# EAGLE design FreedomFighterPif (EAGLE 6.5.0)

## Sheet 1 of 2
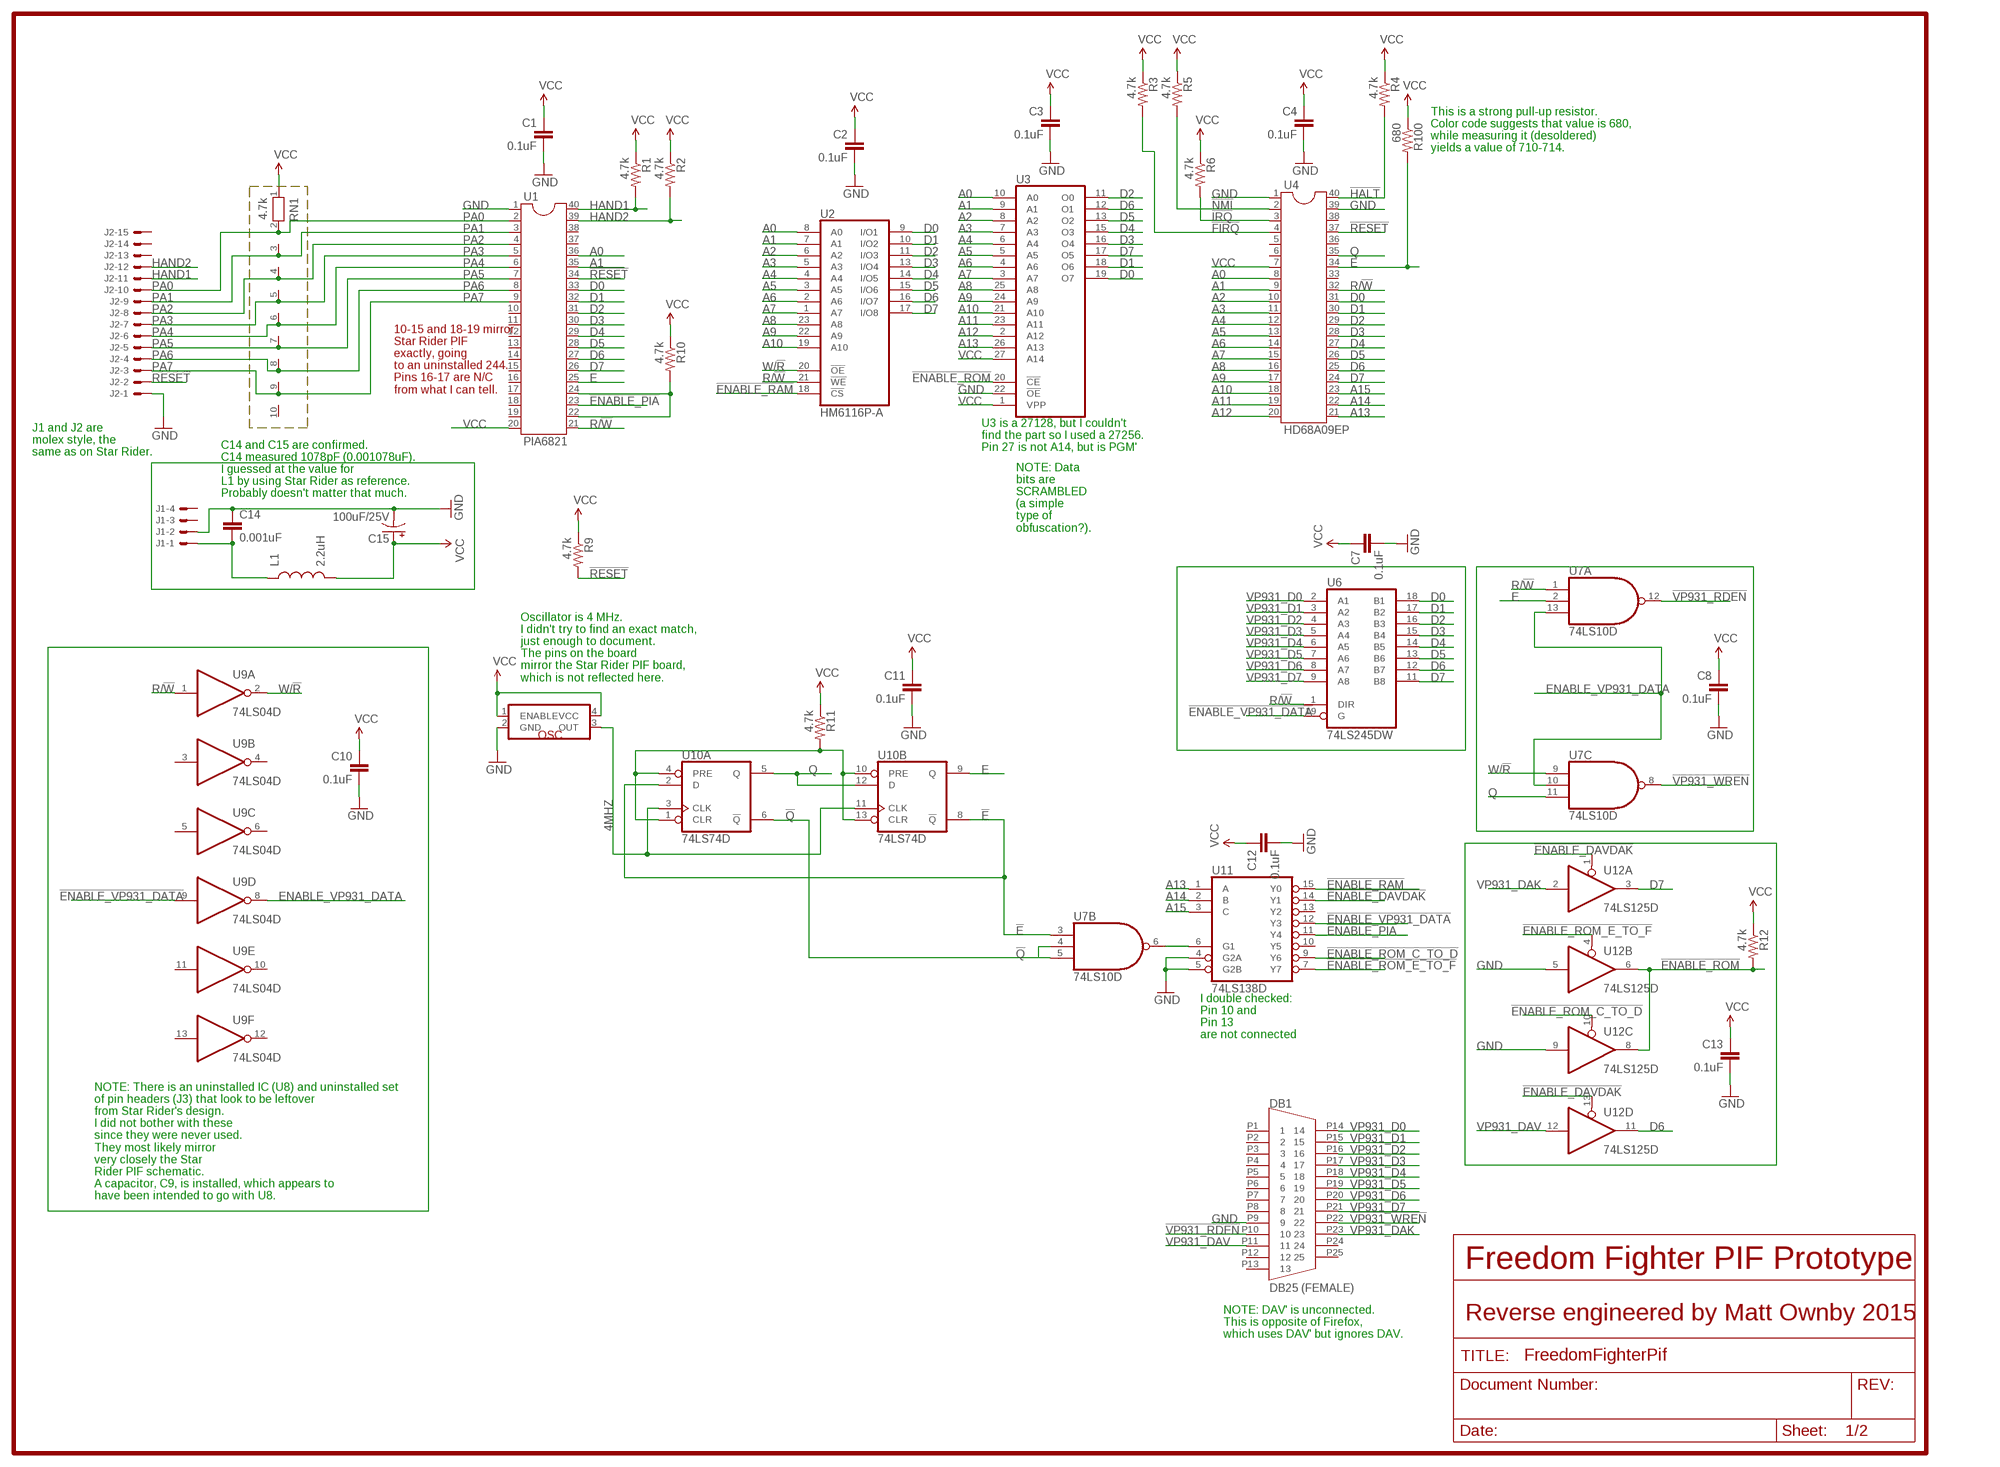
[diagram p0: schematic, sheet 1]

### Parts
C1  0.1uF  CAP1206  [1206]
C2  0.1uF  CAP1206  [1206]
C3  0.1uF  CAP1206  [1206]
C4  0.1uF  CAP1206  [1206]
C7  0.1uF  CAP1206  [1206]
C8  0.1uF  CAP1206  [1206]
C10  0.1uF  CAP1206  [1206]
C11  0.1uF  CAP1206  [1206]
C12  0.1uF  CAP1206  [1206]
C13  0.1uF  CAP1206  [1206]
C14  0.001uF  CAP1206  [1206]
C15  100uF/25V  CAP_POLPTH2  [CPOL-RADIAL-10UF-25V]
DB1  DB25 (FEMALE)  A32077-ND  [A32077-ND]
J1  KK-156-4  [KK-156-4]
J2  KK-156-15  [KK-156-15]
L1  2.2uH  INDUCTOR1206H*  [INDUCTOR-1206]
R1  4.7k  RESISTOR1206  [1206]
R2  4.7k  RESISTOR1206  [1206]
R3  4.7k  RESISTOR1206  [1206]
R4  4.7k  RESISTOR1206  [1206]
R5  4.7k  RESISTOR1206  [1206]
R6  4.7k  RESISTOR1206  [1206]
R9  4.7k  RESISTOR1206  [1206]
R10  4.7k  RESISTOR1206  [1206]
R11  4.7k  RESISTOR1206  [1206]
R12  4.7k  RESISTOR1206  [1206]
R100  680  RESISTOR1206  [1206]
RN1  4.7k  RN09  [RN-10]
U1  PIA6821  DIL40  [DIL40]
U2  HM6116P-A  6116S  [SO24-2]
U3  27256  [DIL28]
U4  HD68A09EP  DIL40  [DIL40]
U6  74LS245DW  [SO20W]
U7  74LS10D  [SO14]
U9  74LS04D  [SO14]
U10  74LS74D  [SO14]
U11  74LS138D  [SO16]
U12  74LS125D  [SO14]
U$1  OSCILLATOR-SMT4  [SMT4-7MMX5MM]

### Nets
4MHZ: U10.3(A:CLK) U10.11(B:CLK) U$1.3(OUT)
!E: U7.3(B:I0) U10.2(A:D) U10.8(B:!Q)
!ENABLE_DAVDAK: U11.14(Y1) U12.1(A:OE) U12.13(D:OE) ; also sheet 2
!ENABLE_PIA: U1.23 U11.11(Y4) ; also sheet 2
!ENABLE_RAM: U2.18(!CS) U11.15(Y0) ; also sheet 2
!ENABLE_ROM: R12.2 U3.20(!CE) U12.6(B:O) U12.8(C:O)
!ENABLE_ROM_C_TO_D: U11.9(Y6) U12.10(C:OE) ; also sheet 2
!ENABLE_ROM_E_TO_F: U11.7(Y7) U12.4(B:OE) ; also sheet 2
!ENABLE_VP931_DATA: U6.19(G) U9.9(D:I) U11.12(Y3) ; also sheet 2
!FIRQ: R3.2 U4.4 ; also sheet 2
!HALT: R4.2 U4.40 ; also sheet 2
!IRQ: R6.2 U4.3 ; also sheet 2
!NMI: R5.2 U4.2 ; also sheet 2
!Q: U7.4(B:I1) U7.5(B:I2) U10.6(A:!Q)
!RESET: J2.2 R9.2 U1.34 U4.37 ; also sheet 2
!VP931_RDEN: DB1.P10 U7.12(A:O)
!VP931_WREN: DB1.P22 U7.8(C:O)
A0: U1.36 U2.8(A0) U3.10(A0) U4.8 ; also sheet 2
A1: U1.35 U2.7(A1) U3.9(A1) U4.9 ; also sheet 2
A2: U2.6(A2) U3.8(A2) U4.10 ; also sheet 2
A3: U2.5(A3) U3.7(A3) U4.11 ; also sheet 2
A4: U2.4(A4) U3.6(A4) U4.12 ; also sheet 2
A5: U2.3(A5) U3.5(A5) U4.13 ; also sheet 2
A6: U2.2(A6) U3.4(A6) U4.14 ; also sheet 2
A7: U2.1(A7) U3.3(A7) U4.15 ; also sheet 2
A8: U2.23(A8) U3.25(A8) U4.16 ; also sheet 2
A9: U2.22(A9) U3.24(A9) U4.17 ; also sheet 2
A10: U2.19(A10) U3.21(A10) U4.18 ; also sheet 2
A11: U3.23(A11) U4.19 ; also sheet 2
A12: U3.2(A12) U4.20 ; also sheet 2
A13: U3.26(A13) U4.21 U11.1(A) ; also sheet 2
A14: U4.22 U11.2(B) ; also sheet 2
A15: U4.23 U11.3(C) ; also sheet 2
CS0/CS1: R10.2 U1.22 U1.24
D0: U1.33 U2.9(I/O1) U3.19(O7) U4.31 U6.18(B1) ; also sheet 2
D1: U1.32 U2.10(I/O2) U3.18(O6) U4.30 U6.17(B2) ; also sheet 2
D2: U1.31 U2.11(I/O3) U3.11(O0) U4.29 U6.16(B3) ; also sheet 2
D3: U1.30 U2.13(I/O4) U3.16(O4) U4.28 U6.15(B4) ; also sheet 2
D4: U1.29 U2.14(I/O5) U3.15(O3) U4.27 U6.14(B5) ; also sheet 2
D5: U1.28 U2.15(I/O6) U3.13(O2) U4.26 U6.13(B6) ; also sheet 2
D6: U1.27 U2.16(I/O7) U3.12(O1) U4.25 U6.12(B7) U12.11(D:O) ; also sheet 2
D7: U1.26 U2.17(I/O8) U3.17(O5) U4.24 U6.11(B8) U12.3(A:O) ; also sheet 2
E: R100.2 U1.25 U4.34 U7.2(A:I1) U10.9(B:Q) ; also sheet 2
ENABLE_VP931_DATA: U7.10(C:I1) U7.13(A:I2) U9.8(D:O) ; also sheet 2
GND: C1.2 C2.2 C3.2 C4.2 C7.2 C8.2 C10.2 C11.2 C12.2 C13.2 C14.1 C15.2(-) DB1.P9 J1.2 J2.1 U1.1 U3.22(!OE) U4.1 U4.39 U11.4(G2A) U11.5(G2B) U12.5(B:I) U12.9(C:I) U$1.2(GND) ; also sheet 2
HAND1: J2.11 R1.2 U1.40 ; also sheet 2
HAND2: J2.12 R2.2 U1.39 ; also sheet 2
N$4: U7.6(B:O) U11.6(G1)
N$5: R11.2 U10.1(A:CLR) U10.4(A:PRE) U10.10(B:PRE) U10.13(B:CLR)
N$8: C14.2 J1.1 L1.P$1
PA0: J2.10 RN1.2 U1.2 ; also sheet 2
PA1: J2.9 RN1.3 U1.3 ; also sheet 2
PA2: J2.8 RN1.4 U1.4 ; also sheet 2
PA3: J2.7 RN1.5 U1.5 ; also sheet 2
PA4: J2.6 RN1.6 U1.6 ; also sheet 2
PA5: J2.5 RN1.7 U1.7 ; also sheet 2
PA6: J2.4 RN1.8 U1.8 ; also sheet 2
PA7: J2.3 RN1.9 U1.9 ; also sheet 2
Q: U4.35 U7.11(C:I2) U10.5(A:Q) U10.12(B:D) ; also sheet 2
R/!W: U1.21 U2.21(!WE) U4.32 U6.1(DIR) U7.1(A:I0) U9.1(A:I) ; also sheet 2
VCC: C1.1 C2.1 C3.1 C4.1 C7.1 C8.1 C10.1 C11.1 C12.1 C13.1 C15.1(+) L1.P$2 R1.1 R2.1 R3.1 R4.1 R5.1 R6.1 R9.1 R10.1 R11.1 R12.1 R100.1 RN1.1 U1.20 U3.1(VPP) U3.27(A14) U4.7 U$1.1(ENABLE) U$1.4(VCC) ; also sheet 2
VP931_D0: DB1.P14 U6.2(A1)
VP931_D1: DB1.P15 U6.3(A2)
VP931_D2: DB1.P16 U6.4(A3)
VP931_D3: DB1.P17 U6.5(A4)
VP931_D4: DB1.P18 U6.6(A5)
VP931_D5: DB1.P19 U6.7(A6)
VP931_D6: DB1.P20 U6.8(A7)
VP931_D7: DB1.P21 U6.9(A8)
VP931_DAK: DB1.P23 U12.2(A:I)
VP931_DAV: DB1.P11 U12.12(D:I)
W/!R: U2.20(!OE) U7.9(C:I0) U9.2(A:O) ; also sheet 2
Unconnected: DB1.P1 DB1.P2 DB1.P3 DB1.P4 DB1.P5 DB1.P6 DB1.P7 DB1.P8 DB1.P12 DB1.P13 DB1.P24 DB1.P25 J1.3 J1.4 J2.13 J2.14 J2.15 RN1.10 U1.10 U1.11 U1.12 U1.13 U1.14 U1.15 U1.16 U1.17 U1.18 U1.19 U1.37 U1.38 U4.5 U4.6 U4.33 U4.36 U4.38 U9.3(B:I) U9.4(B:O) U9.5(C:I) U9.6(C:O) U9.10(E:O) U9.11(E:I) U9.12(F:O) U9.13(F:I) U11.10(Y5) U11.13(Y2)

### Notes on the sheet
- This is a strong pull-up resistor.
  Color code suggests that value is 680,
  while measuring it (desoldered) 
  yields a value of 710-714.
- 10-15 and 18-19 mirror
  Star Rider PIF
  exactly, going
  to an uninstalled 244.
  Pins 16-17 are N/C
  from what I can tell.
- U3 is a 27128, but I couldn't
  find the part so I used a 27256.
  Pin 27 is not A14, but is PGM'
- J1 and J2 are
  molex style, the
  same as on Star Rider.
- C14 and C15 are confirmed.
  C14 measured 1078pF (0.001078uF).
  I guessed at the value for
  L1 by using Star Rider as reference.
  Probably doesn't matter that much.
- NOTE: Data
  bits are
  SCRAMBLED
  (a simple
  type of
  obfuscation?).
- Oscillator is 4 MHz.
  I didn't try to find an exact match,
  just enough to document.
  The pins on the board
  mirror the Star Rider PIF board,
  which is not reflected here.
- I double checked:
  Pin 10 and 
  Pin 13
  are not connected
- NOTE: There is an uninstalled IC (U8) and uninstalled set
  of pin headers (J3) that look to be leftover
  from Star Rider's design.
  I did not bother with these
  since they were never used.
  They most likely mirror
  very closely the Star
  Rider PIF schematic.
  A capacitor, C9, is installed, which appears to
  have been intended to go with U8.
- Freedom Fighter PIF Prototype
- Reverse engineered by Matt Ownby 2015
- NOTE: DAV' is unconnected.
  This is opposite of Firefox,
  which uses DAV' but ignores DAV.

## Sheet 2 of 2
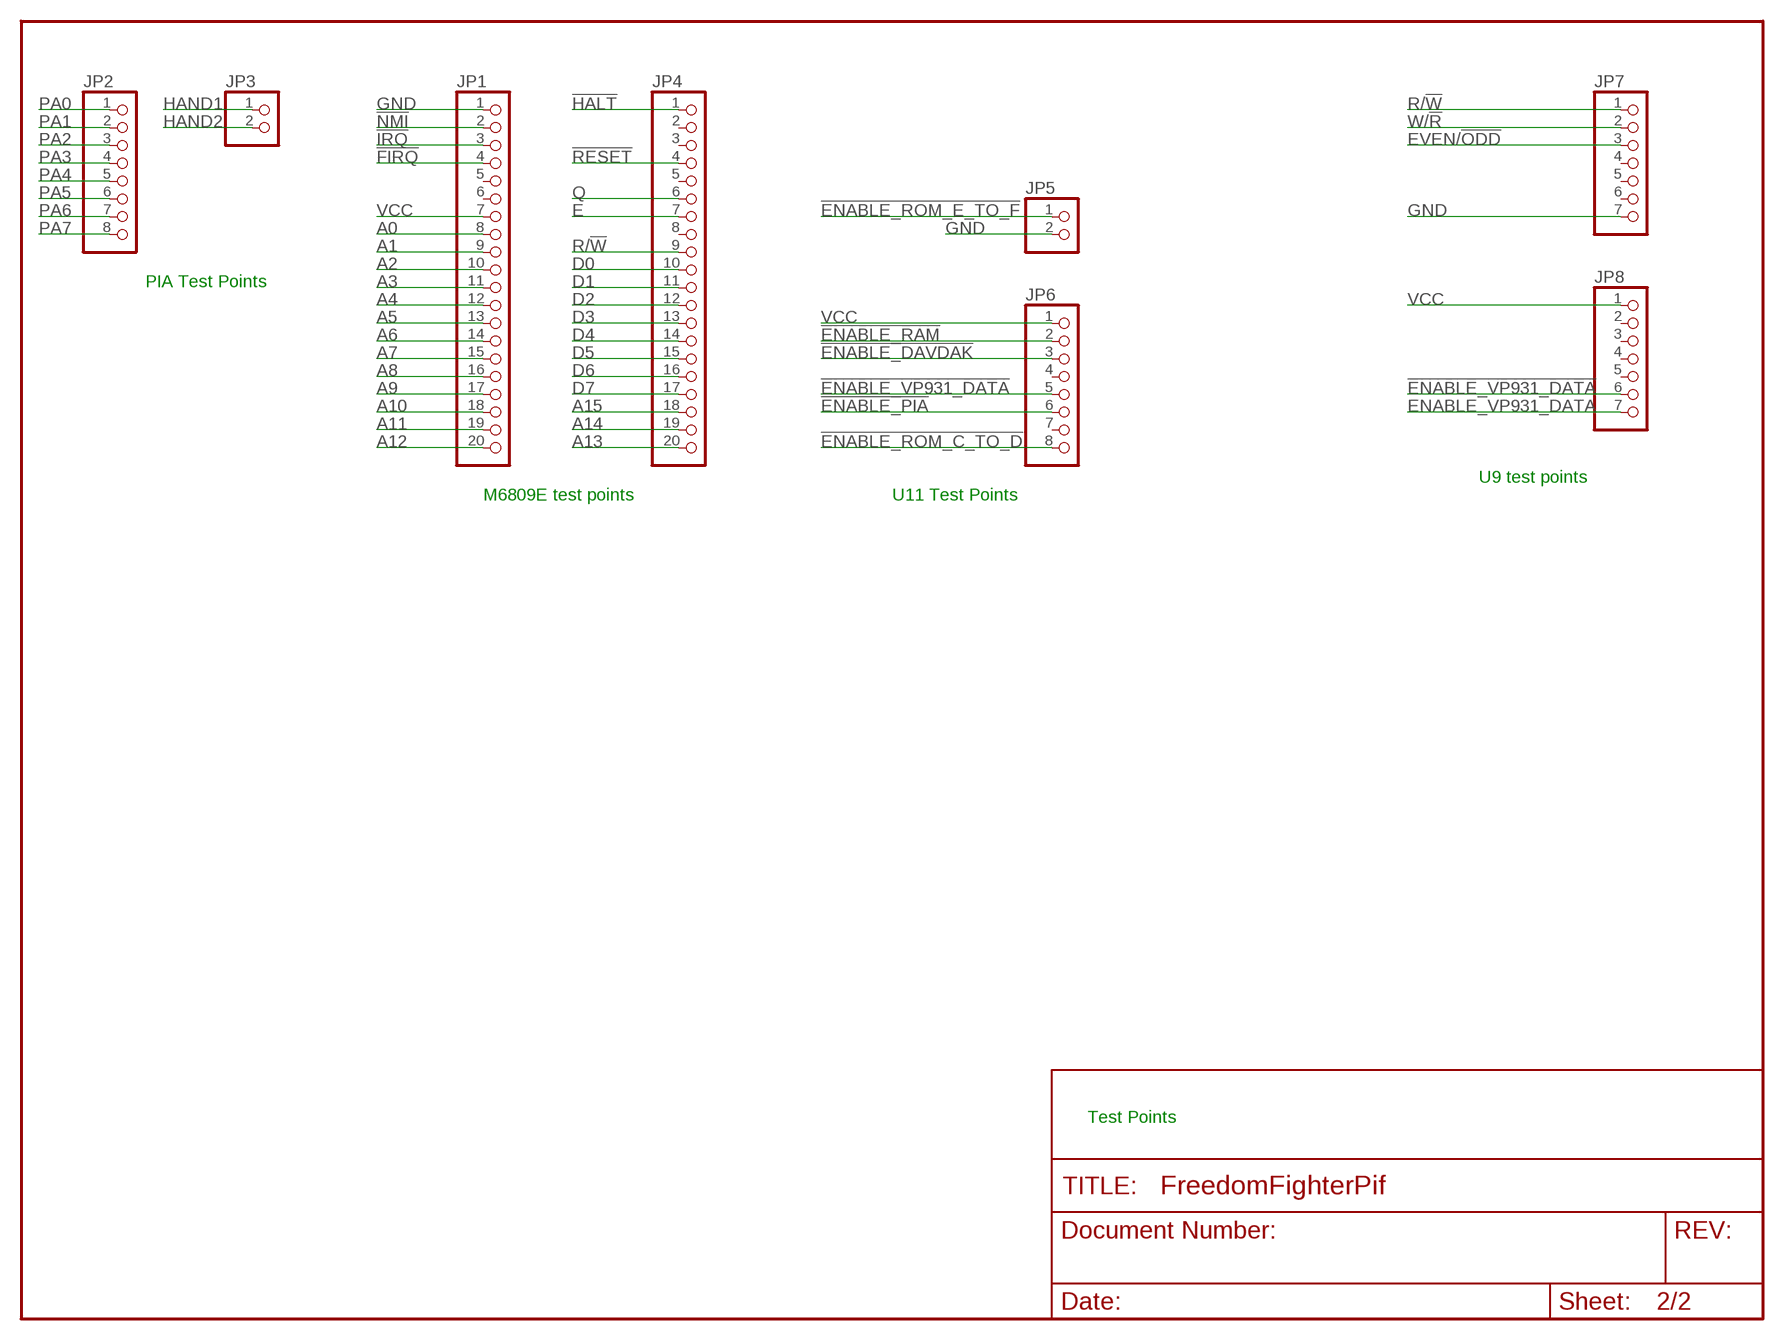
[diagram p1: schematic, sheet 2]

### Parts
JP1  PINHD-1X20  [1X20]
JP2  PINHD-1X8  [1X08]
JP3  PINHD-1X2  [1X02]
JP4  PINHD-1X20  [1X20]
JP5  PINHD-1X2  [1X02]
JP6  PINHD-1X8  [1X08]
JP7  PINHD-1X7  [1X07]
JP8  PINHD-1X7  [1X07]

### Nets
!ENABLE_DAVDAK: JP6.3 ; also sheet 1
!ENABLE_PIA: JP6.6 ; also sheet 1
!ENABLE_RAM: JP6.2 ; also sheet 1
!ENABLE_ROM_C_TO_D: JP6.8 ; also sheet 1
!ENABLE_ROM_E_TO_F: JP5.1 ; also sheet 1
!ENABLE_VP931_DATA: JP6.5 JP8.6 ; also sheet 1
!FIRQ: JP1.4 ; also sheet 1
!HALT: JP4.1 ; also sheet 1
!IRQ: JP1.3 ; also sheet 1
!NMI: JP1.2 ; also sheet 1
!RESET: JP4.4 ; also sheet 1
A0: JP1.8 ; also sheet 1
A1: JP1.9 ; also sheet 1
A2: JP1.10 ; also sheet 1
A3: JP1.11 ; also sheet 1
A4: JP1.12 ; also sheet 1
A5: JP1.13 ; also sheet 1
A6: JP1.14 ; also sheet 1
A7: JP1.15 ; also sheet 1
A8: JP1.16 ; also sheet 1
A9: JP1.17 ; also sheet 1
A10: JP1.18 ; also sheet 1
A11: JP1.19 ; also sheet 1
A12: JP1.20 ; also sheet 1
A13: JP4.20 ; also sheet 1
A14: JP4.19 ; also sheet 1
A15: JP4.18 ; also sheet 1
D0: JP4.10 ; also sheet 1
D1: JP4.11 ; also sheet 1
D2: JP4.12 ; also sheet 1
D3: JP4.13 ; also sheet 1
D4: JP4.14 ; also sheet 1
D5: JP4.15 ; also sheet 1
D6: JP4.16 ; also sheet 1
D7: JP4.17 ; also sheet 1
E: JP4.7 ; also sheet 1
ENABLE_VP931_DATA: JP8.7 ; also sheet 1
EVEN/!ODD: JP7.3
GND: JP1.1 JP5.2 JP7.7 ; also sheet 1
HAND1: JP3.1 ; also sheet 1
HAND2: JP3.2 ; also sheet 1
PA0: JP2.1 ; also sheet 1
PA1: JP2.2 ; also sheet 1
PA2: JP2.3 ; also sheet 1
PA3: JP2.4 ; also sheet 1
PA4: JP2.5 ; also sheet 1
PA5: JP2.6 ; also sheet 1
PA6: JP2.7 ; also sheet 1
PA7: JP2.8 ; also sheet 1
Q: JP4.6 ; also sheet 1
R/!W: JP4.9 JP7.1 ; also sheet 1
VCC: JP1.7 JP6.1 JP8.1 ; also sheet 1
W/!R: JP7.2 ; also sheet 1
Unconnected: JP1.5 JP1.6 JP4.2 JP4.3 JP4.5 JP4.8 JP6.4 JP6.7 JP7.4 JP7.5 JP7.6 JP8.2 JP8.3 JP8.4 JP8.5

### Notes on the sheet
- PIA Test Points
- U9 test points
- M6809E test points | U11 Test Points
- Test Points

## Power pins joined to a net without a drawn wire
GND: U2.12(GND) U3.14(GND) U6.10(GND) U7.7(P:GND) U9.7(P:GND) U10.7(P:GND) U11.8(GND) U12.7(P:GND)
VCC: U2.24(VCC) U3.28(VCC) U6.20(VCC) U7.14(P:VCC) U9.14(P:VCC) U10.14(P:VCC) U11.16(VCC) U12.14(P:VCC)

## Library data of the parts
C1-C4 C7 C8 C10-C14 = SparkFun:CAP: Capacitor Standard 0603 ceramic capacitor, and 0.1" leaded capacitor.
C15 = SparkFun:CAP_POL: Capacitor Polarized These are standard SMD and PTH capacitors. Normally 10uF, 47uF, and 100uF in electrolytic and tantalum varieties. Always verify the external diameter of the through hole cap, it varies with capacity, voltage, and manufacturer. The EIA devices should be standard.
DB1 = mpo:A32077-ND: DB2 female right-angle Digikey A32077-ND
J1 = con-molex:KK-156-4: KK 156 HEADER Source: http://www.molex.com/pdm_docs/sd/026604100_sd.pdf; OC_FARNELL: unknown; OC_NEWARK: unknown
J2 = con-molex:KK-156-15: KK 156 HEADER Source: http://www.molex.com/pdm_docs/sd/026604100_sd.pdf; OC_FARNELL: unknown; OC_NEWARK: unknown
JP1 JP4 = pinhead:PINHD-1X20: PIN HEADER
JP2 JP6 = pinhead:PINHD-1X8: PIN HEADER
JP3 JP5 = pinhead:PINHD-1X2: PIN HEADER
JP7 JP8 = pinhead:PINHD-1X7: PIN HEADER
L1 = SparkFun:INDUCTOR: Inductors Basic Inductor/Choke - 0603 and 1206. Footprints are not proven and vary greatly between part numbers.
R1-R6 R9-R12 R100 = SparkFun:RESISTOR: Resistor Basic schematic elements and footprints for 0603, 1206, and PTH resistors.
RN1 = resistor-net:RN09: RESISTOR NETWORK; OC_FARNELL: unknown; OC_NEWARK: unknown
U1 U4 = ic-package:DIL40: Dual In Line
U2 = memory-idt:6116S: MEMORY; OC_FARNELL: unknown; OC_NEWARK: unknown
U3 = memory:27256: MEMORY
U6 = 74xx-us:74*245: Octal BUS TRANSCEIVER, 3-state
U7 = 74xx-us:74*10: Triple 3-input NAND gate
U9 = 74xx-us:74*04: Hex INVERTER
U10 = 74xx-us:74*74: Dual D type positive edge triggered FLIP FLOP, preset and clear
U11 = 74xx-us:74*138: 3-line to 8-line DECODER/DEMULTIPLEXER
U12 = 74xx-eu:74*125: Quad bus BUFFER, 3-state
U$1 = mpo:OSCILLATOR-SMT4

## Board
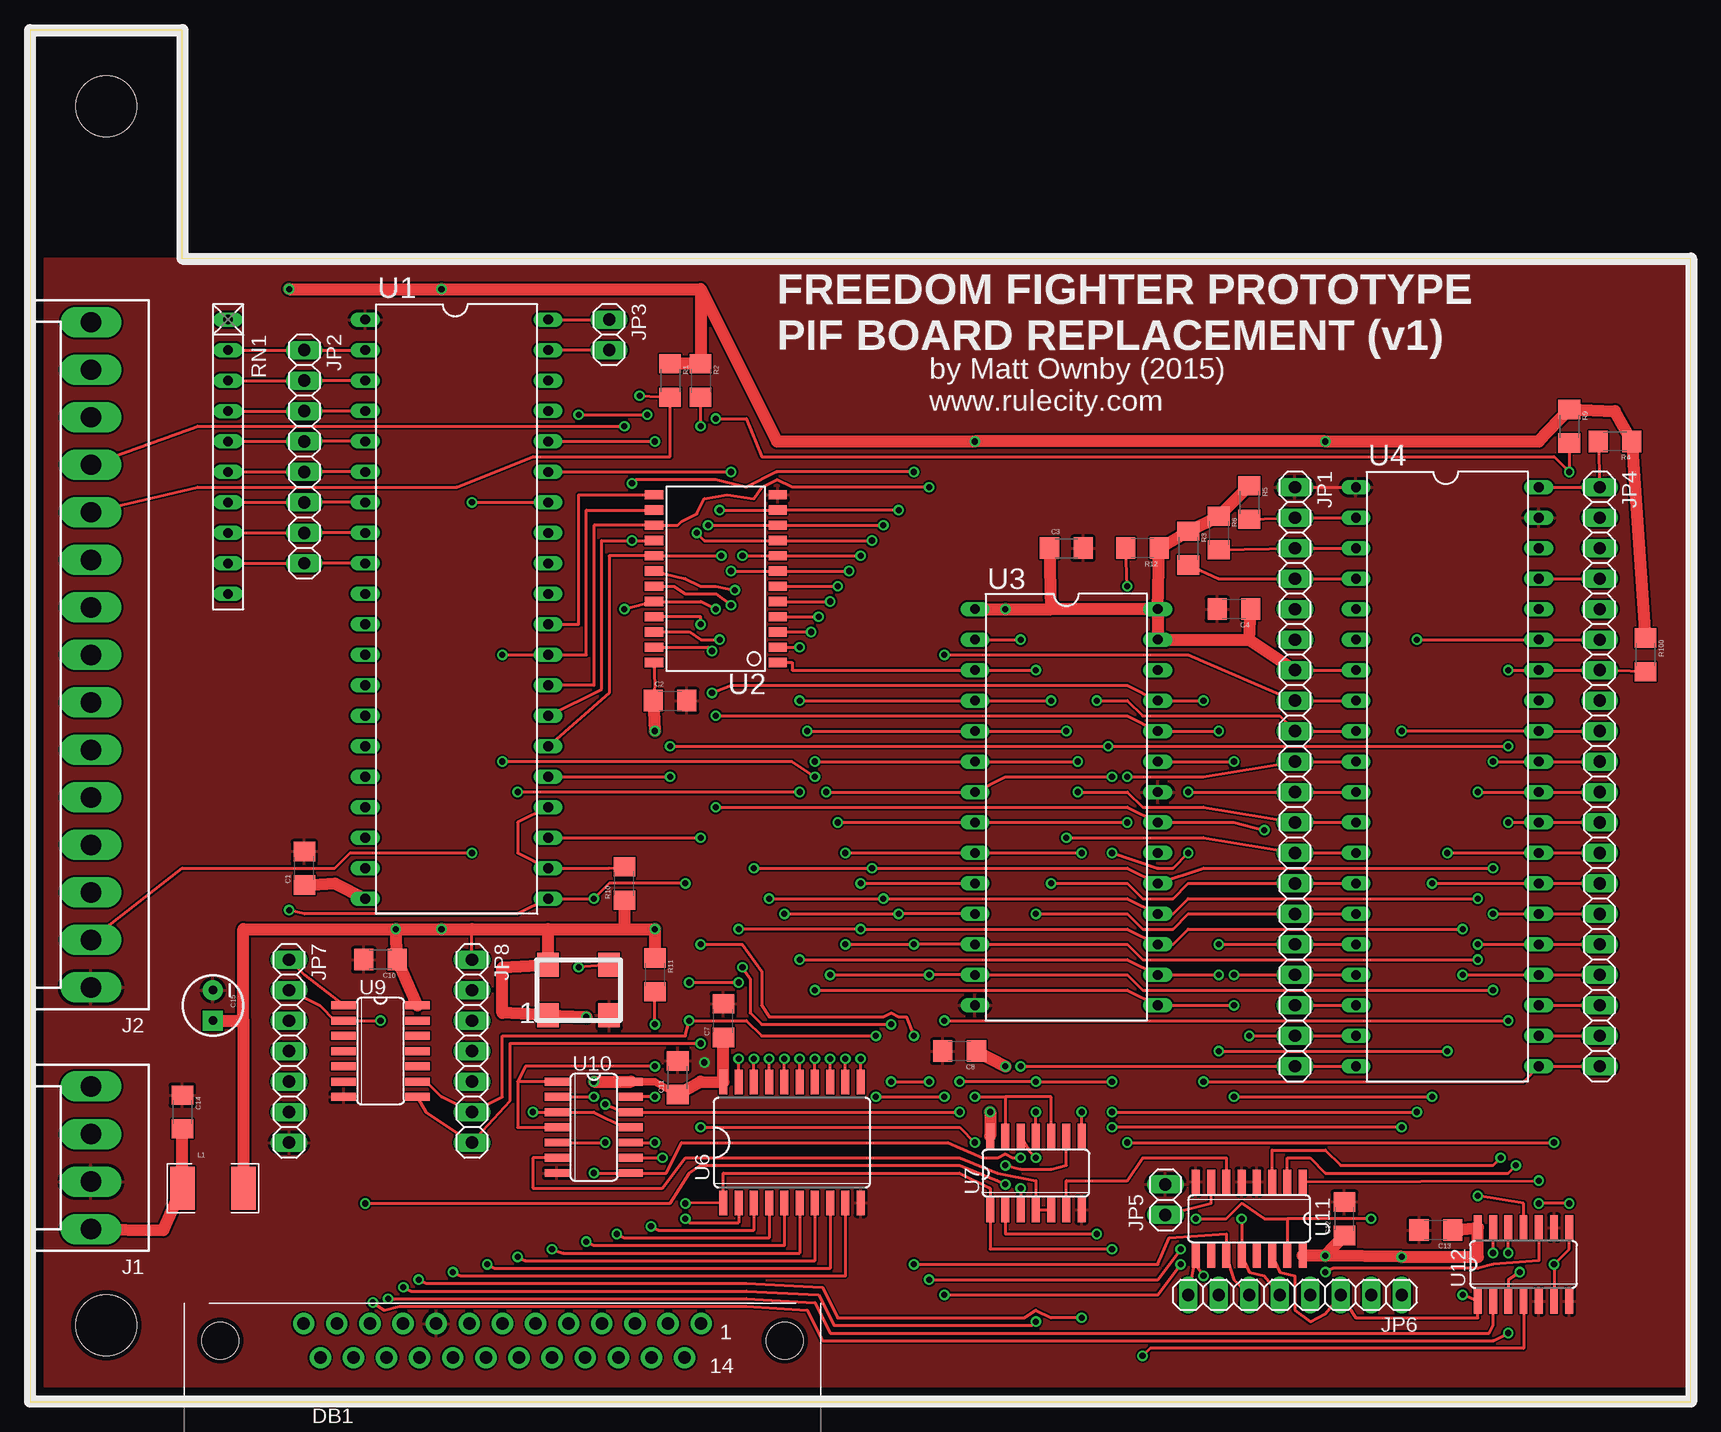
[diagram p2: board, top side]
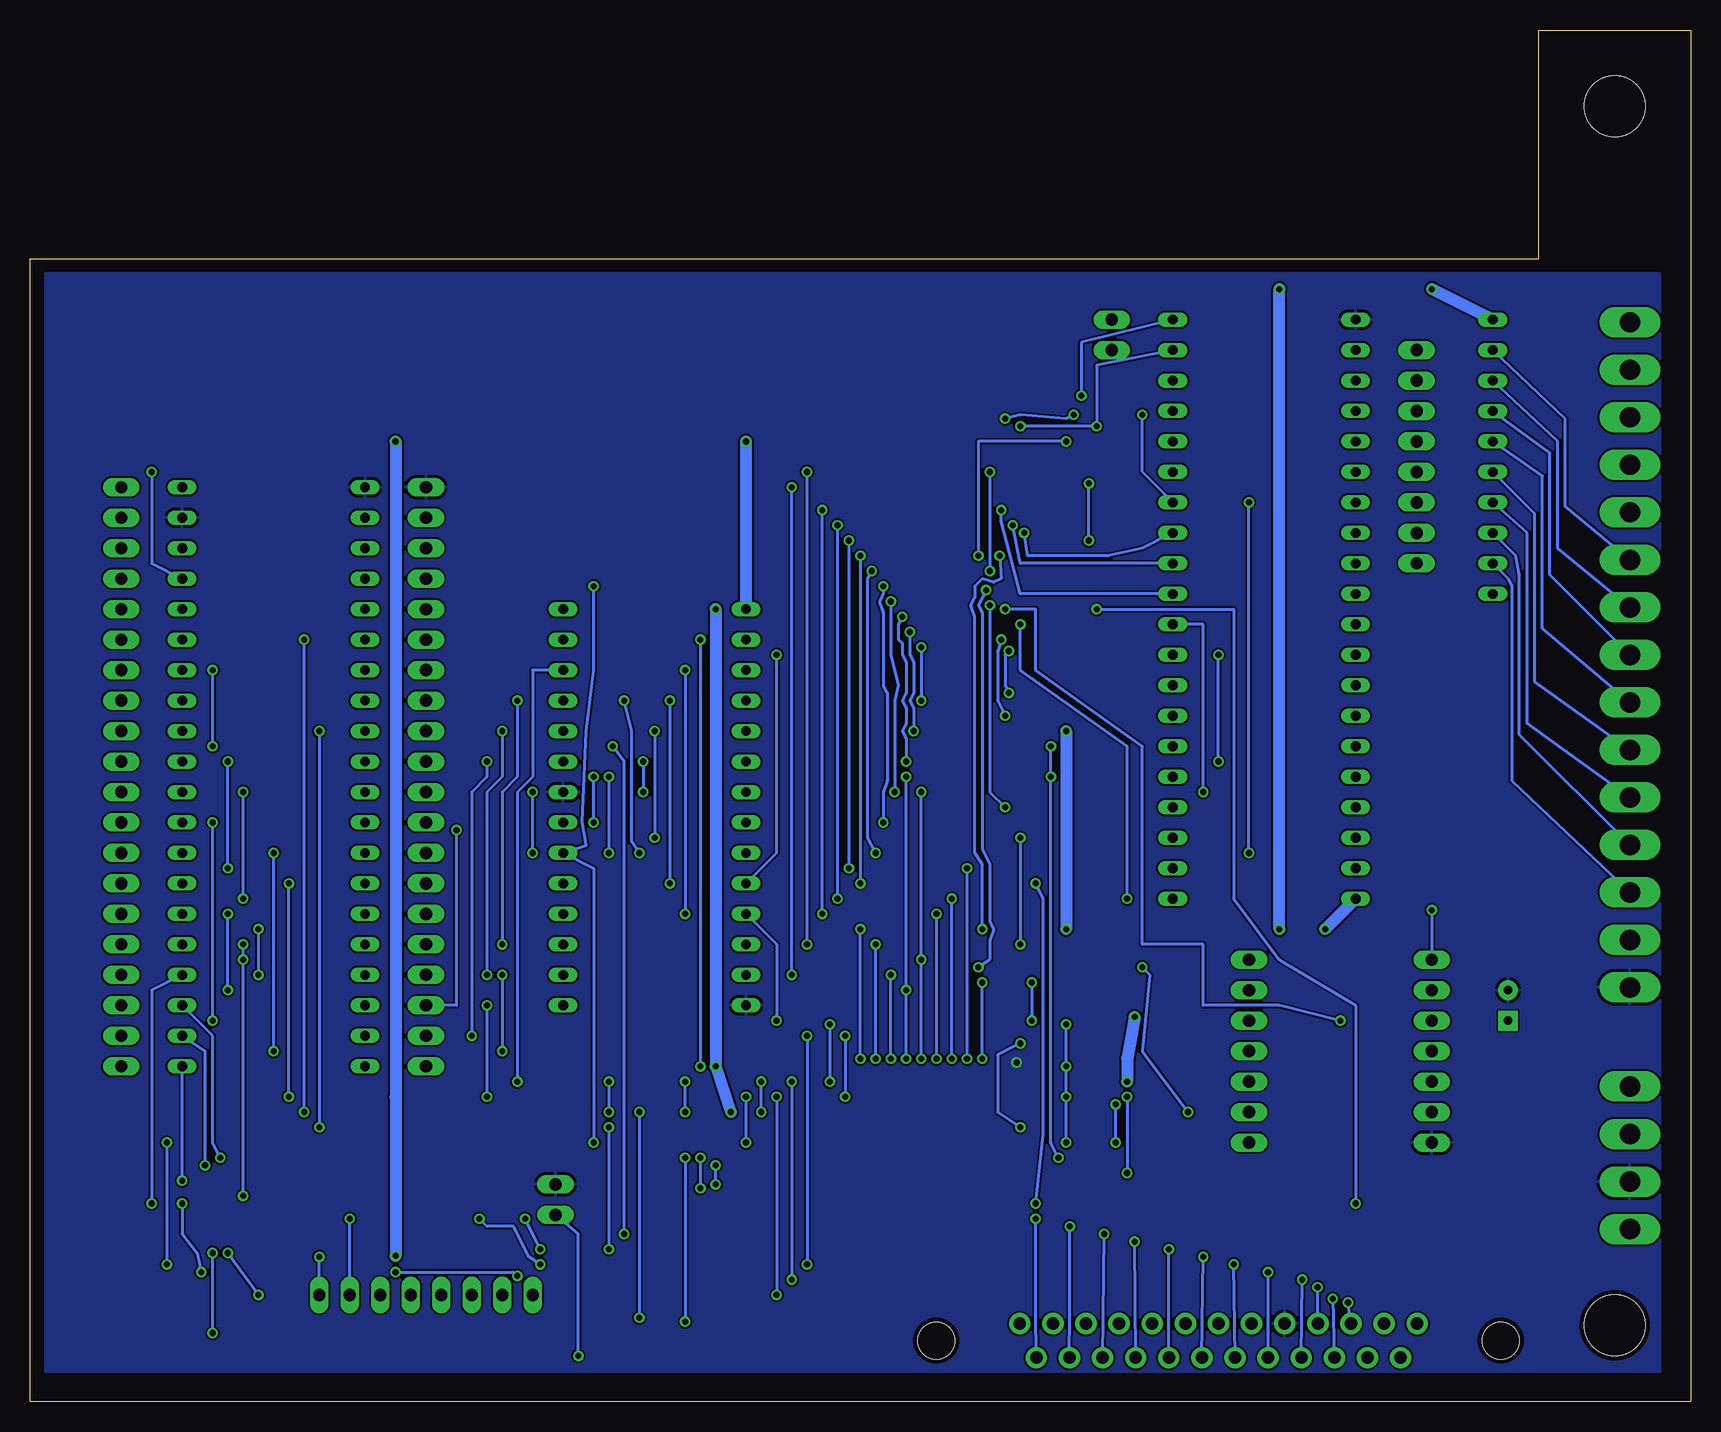
[diagram p3: board, bottom side, seen from below]

Size 138.41 x 114.3 mm. Coordinates in mm from the lower left corner, seen from the top.
Outline: 0,0 138.41,0 138.41,95.25 12.7,95.25 12.7,114.3 0,114.3 0,0
Copper layers (1*16): Top 0.0356mm / dielectric 1.5011mm / Bottom 0.0356mm
Design rules "OSHParkLaenPCBOrder": minimum track width 6mil, minimum drill 13mil, track to track 6mil, track to pad 6mil, pad to pad 6mil, via to via 6mil, smd to smd 6mil, copper to edge 15mil, drill to drill 6mil, minimum pad ring 7mil, minimum via ring 7mil, stop-mask expansion 3mil, vias tented up to drill 0mil, thermal gap 10mil
Holes 5.08 mm at 6.35,6.35 6.35,107.95

### Footprints (pad centres in the part's own frame; a part is rotated, then mirrored left to right if it is on the bottom)
1206 = smd 1.6 x 1.8: 1 -1.4,0; 2 1.4,0
CPOL-RADIAL-10UF-25V = drill 0.7 pad 1.651 square: 1 1.27,0 | drill 0.7 pad 1.651: 2 -1.27,0
A32077-ND = drill 1.041 pad 1.778: P1 -16.561,-1.422; P2 -13.801,-1.422; P3 -11.04,-1.422; P4 -8.28,-1.422; P5 -5.52,-1.422; P6 -2.76,-1.422; P7 0,-1.422; P8 2.76,-1.422; P9 5.52,-1.422; P10 8.28,-1.422; P11 11.04,-1.422; P12 13.801,-1.422; P13 16.561,-1.422; P14 -15.182,1.422; P15 -12.417,1.422; P16 -9.658,1.422; P17 -6.898,1.422; P18 -4.139,1.422; P19 -1.38,1.422; P20 1.38,1.422; P21 4.139,1.422; P22 6.898,1.422; P23 9.658,1.422; P24 12.417,1.422; P25 15.171,1.422 | hole 3.048: -23.52,0; 23.52,0
KK-156-4 = drill 1.7 pad 2.184 long: 1 -5.94,0; 2 -1.98,0; 3 1.98,0; 4 5.94,0
KK-156-15 = drill 1.7 pad 2.184 long: 1 -27.72,0; 2 -23.76,0; 3 -19.8,0; 4 -15.84,0; 5 -11.88,0; 6 -7.92,0; 7 -3.96,0; 8 0,0; 9 3.96,0; 10 7.92,0; 11 11.88,0; 12 15.84,0; 13 19.8,0; 14 23.76,0; 15 27.72,0
1X20 = drill 1.016 long: 1 -24.13,0; 2 -21.59,0; 3 -19.05,0; 4 -16.51,0; 5 -13.97,0; 6 -11.43,0; 7 -8.89,0; 8 -6.35,0; 9 -3.81,0; 10 -1.27,0; 11 1.27,0; 12 3.81,0; 13 6.35,0; 14 8.89,0; 15 11.43,0; 16 13.97,0; 17 16.51,0; 18 19.05,0; 19 21.59,0; 20 24.13,0
1X08 = drill 1.016 long: 1 -8.89,0; 2 -6.35,0; 3 -3.81,0; 4 -1.27,0; 5 1.27,0; 6 3.81,0; 7 6.35,0; 8 8.89,0
1X02 = drill 1.016 long: 1 -1.27,0; 2 1.27,0
1X07 = drill 1.016 long: 1 -7.62,0; 2 -5.08,0; 3 -2.54,0; 4 0,0; 5 2.54,0; 6 5.08,0; 7 7.62,0
INDUCTOR-1206 = smd 2.032 x 3.556: P$1 -2.54,0; P$2 2.54,0
RN-10 = drill 0.813 long: 1 -11.43,0; 2 -8.89,0; 3 -6.35,0; 4 -3.81,0; 5 -1.27,0; 6 1.27,0; 7 3.81,0; 8 6.35,0; 9 8.89,0; 10 11.43,0
DIL40 = drill 0.813 long: 1 -24.13,-7.62; 2 -21.59,-7.62; 3 -19.05,-7.62; 4 -16.51,-7.62; 5 -13.97,-7.62; 6 -11.43,-7.62; 7 -8.89,-7.62; 8 -6.35,-7.62; 9 -3.81,-7.62; 10 -1.27,-7.62; 11 1.27,-7.62; 12 3.81,-7.62; 13 6.35,-7.62; 14 8.89,-7.62; 15 11.43,-7.62; 16 13.97,-7.62; 17 16.51,-7.62; 18 19.05,-7.62; 19 21.59,-7.62; 20 24.13,-7.62; 21 24.13,7.62; 22 21.59,7.62; 23 19.05,7.62; 24 16.51,7.62; 25 13.97,7.62; 26 11.43,7.62; 27 8.89,7.62; 28 6.35,7.62; 29 3.81,7.62; 30 1.27,7.62; 31 -1.27,7.62; 32 -3.81,7.62; 33 -6.35,7.62; 34 -8.89,7.62; 35 -11.43,7.62; 36 -13.97,7.62; 37 -16.51,7.62; 38 -19.05,7.62; 39 -21.59,7.62; 40 -24.13,7.62
SO24-2 = smd 0.762 x 1.524: 1 -6.985,-5.156; 2 -5.715,-5.156; 3 -4.445,-5.156; 4 -3.175,-5.156; 5 -1.905,-5.156; 6 -0.635,-5.156; 7 0.635,-5.156; 8 1.905,-5.156; 9 3.175,-5.156; 10 4.445,-5.156; 11 5.715,-5.156; 12 6.985,-5.156; 13 6.985,5.156; 14 5.715,5.156; 15 4.445,5.156; 16 3.175,5.156; 17 1.905,5.156; 18 0.635,5.156; 19 -0.635,5.156; 20 -1.905,5.156; 21 -3.175,5.156; 22 -4.445,5.156; 23 -5.715,5.156; 24 -6.985,5.156
DIL28 = drill 0.813 long: 1 -16.51,-7.62; 2 -13.97,-7.62; 3 -11.43,-7.62; 4 -8.89,-7.62; 5 -6.35,-7.62; 6 -3.81,-7.62; 7 -1.27,-7.62; 8 1.27,-7.62; 9 3.81,-7.62; 10 6.35,-7.62; 11 8.89,-7.62; 12 11.43,-7.62; 13 13.97,-7.62; 14 16.51,-7.62; 15 16.51,7.62; 16 13.97,7.62; 17 11.43,7.62; 18 8.89,7.62; 19 6.35,7.62; 20 3.81,7.62; 21 1.27,7.62; 22 -1.27,7.62; 23 -3.81,7.62; 24 -6.35,7.62; 25 -8.89,7.62; 26 -11.43,7.62; 27 -13.97,7.62; 28 -16.51,7.62
SO20W = smd 0.66 x 2.032: 1 -5.715,-5.029; 2 -4.445,-5.029; 3 -3.175,-5.029; 4 -1.905,-5.029; 5 -0.635,-5.029; 6 0.635,-5.029; 7 1.905,-5.029; 8 3.175,-5.029; 9 4.445,-5.029; 10 5.715,-5.029; 11 5.715,5.029; 12 4.445,5.029; 13 3.175,5.029; 14 1.905,5.029; 15 0.635,5.029; 16 -0.635,5.029; 17 -1.905,5.029; 18 -3.175,5.029; 19 -4.445,5.029; 20 -5.715,5.029
SO14 = smd 0.66 x 2.032: 1 -3.81,-3.073; 2 -2.54,-3.073; 3 -1.27,-3.073; 4 0,-3.073; 5 1.27,-3.073; 6 2.54,-3.073; 7 3.81,-3.073; 8 3.81,3.073; 9 2.54,3.073; 10 1.27,3.073; 11 0,3.073; 12 -1.27,3.073; 13 -2.54,3.073; 14 -3.81,3.073
SO16 = smd 0.66 x 2.032: 1 -4.445,-3.073; 2 -3.175,-3.073; 3 -1.905,-3.073; 4 -0.635,-3.073; 5 0.635,-3.073; 6 1.905,-3.073; 7 3.175,-3.073; 8 4.445,-3.073; 9 4.445,3.073; 10 3.175,3.073; 11 1.905,3.073; 12 0.635,3.073; 13 -0.635,3.073; 14 -1.905,3.073; 15 -3.175,3.073; 16 -4.445,3.073
SMT4-7MMX5MM = smd 1.8 x 2: 1 -2.54,-2.1; 2 2.54,-2.1; 3 2.54,2.1; 4 -2.54,2.1

### Placement (x,y rotation side)
C1  22.86,44.45 90 top
C2  53.34,58.42 0 top
C3  86.36,71.12 0 top
C4  100.33,66.04 180 top
C7  57.78,31.75 90 top
C8  77.47,29.21 180 top
C10  29.21,36.83 180 top
C11  53.98,26.99 90 top
C12  109.54,15.24 90 top
C13  117.16,14.29 180 top
C14  12.7,24.13 270 top
C15  15.24,33.02 270 top
DB1  39.37,5.08 180 top
J1  5.08,20.32 90 top
J2  5.08,62.23 90 top
JP1  105.41,52.07 270 top
JP2  22.86,78.74 270 top
JP3  48.26,88.9 270 top
JP4  130.81,52.07 270 top
JP5  94.61,16.83 90 top
JP6  105.41,8.89 180 top
JP7  21.59,29.21 270 top
JP8  36.83,29.21 270 top
L1  15.24,17.78 0 top
R1  53.34,85.09 270 top
R2  55.88,85.09 270 top
R3  96.52,71.12 270 top
R4  132.08,80.01 180 top
R5  101.6,74.93 270 top
R6  99.06,72.39 270 top
R9  128.27,81.28 270 top
R10  49.53,43.18 90 top
R11  52.07,35.56 270 top
R12  92.71,71.12 180 top
R100  134.62,62.23 270 top
RN1  16.51,78.74 270 top
U1  35.56,66.04 270 top
U2  57.15,68.58 90 top
U3  86.36,49.53 270 top
U4  118.11,52.07 270 top
U6  63.5,21.59 0 top
U7  83.82,19.05 0 top
U9  29.21,29.21 270 top
U10  46.99,22.86 270 top
U11  101.6,15.24 180 top
U12  124.46,11.43 0 top
U$1  45.72,34.29 0 top

### Tracks (layer width: path | path; a pad name or v marks a point on that pad's centre or on a via)
4MHZ  (via drill 0.51)
  Top 0.254: U$1.3 v45.72,36.2 | v41.91,24.13 U10.3 46.99,24.13 49.53,22.86 U10.11
  Bottom 0.254: v45.72,36.2 45.09,35.56 45.72,29.21 v41.91,24.13
!E  (via drill 0.51)
  Top 0.254: U10.2 v46.99,25.4 | v46.99,19.05 U10.8 53.02,19.05 54.29,21.59 76.52,21.59 79.38,20.32 80.64,20.32 81.28,20.64 81.92,20.32 v82.55,20.32 | v82.55,17.78 U7.3
  Bottom 0.254: v46.99,25.4 v46.99,19.05 | v82.55,20.32 v82.55,17.78
!ENABLE_DAVDAK  (via drill 0.51)
  Top 0.254: U11.14 104.14,10.79 105.41,10.48 105.41,7.62 106.68,6.67 107.95,7.3 JP6.3 110.49,6.99 120.65,6.99 U12.1 v119.38,8.89 | v121.92,12.38 U12.13
  Bottom 0.254: v119.38,8.89 v121.92,12.38
!ENABLE_PIA  (via drill 0.51)
  Top 0.254: U1.23 v55.88,46.99 | v55.88,38.1 59.37,38.1 60.96,35.88 60.96,33.02 61.59,32.07 71.12,32.07 71.75,32.38 72.39,32.07 73.03,32.07 v73.66,30.48 | v73.66,11.43 93.98,11.43 94.93,13.65 99.69,13.97 U11.11 100.33,10.16 JP6.6
  Bottom 0.254: v55.88,46.99 v55.88,38.1 | v73.66,30.48 v73.66,11.43
!ENABLE_RAM  (via drill 0.51)
  Top 0.254: U2.18 54.61,68.58 55.88,67.94 57.15,67.94 v58.74,67.63 | v59.37,36.2 60.01,35.24 60.01,32.38 60.96,31.43 v71.75,31.43 | v71.75,26.67 v74.93,26.67 | v74.93,10.16 93.98,10.16 v95.89,12.7 | v97.16,15.24 99.69,15.24 100.97,16.51 102.87,15.24 104.78,15.24 | 104.78,15.24 U11.15 | v111.76,15.24 104.78,15.24
  Bottom 0.254: v58.74,67.63 59.37,66.36 59.05,65.72 59.05,46.04 58.42,44.77 58.42,40.01 58.1,39.37 58.42,38.42 58.42,36.83 v59.37,36.2 | v71.75,31.43 v71.75,26.67 | v74.93,26.67 v74.93,10.16 | v95.89,12.7 v97.16,15.24 | JP6.2 v111.76,15.24
!ENABLE_ROM  (via drill 0.51)
  Top 0.254: v91.44,67.94 R12.2 | v91.44,21.59 v127,21.59 | U12.6 v127,11.43 128.27,12.7 U12.8
  Bottom 0.254: v91.44,67.94 91.44,60.96 92.08,55.88 92.39,48.26 92.08,46.35 U3.20 91.44,44.45 v91.44,21.59 | v127,21.59 v127,11.43
!ENABLE_ROM_C_TO_D  (via drill 0.51)
  Top 0.254: U11.9 97.04,11.57 | 97.04,11.57 JP6.8 | U12.10 125.73,11.75 121.92,11.43 120.65,11.11 108.58,11.11 v107.95,10.79 | v97.79,10.48 97.04,11.57
  Bottom 0.254: v107.95,10.79 98.11,10.79 v97.79,10.48
!ENABLE_ROM_E_TO_F  (via drill 0.51)
  Top 0.254: JP5.1 98.42,16.51 U11.7 | U12.4 124.46,4.45 93.34,4.45 v92.71,3.81
  Bottom 0.254: v92.71,3.81 92.71,13.97 JP5.1
!ENABLE_VP931_DATA  (via drill 0.51)
  Top 0.254: U9.9 33.02,26.67 34.29,25.4 JP8.6 39.37,25.4 39.37,30.48 54.61,30.48 v54.93,31.75 59.69,31.75 60.96,30.48 v70.48,30.48 | U6.19 v59.05,28.57 | v59.05,34.92 v54.93,34.92 | v70.48,25.4 v76.2,25.4 | v76.2,8.89 93.98,8.89 v95.89,11.43 | v100.97,15.24 U11.12 101.6,10.79 102.87,10.48 JP6.5
  Bottom 0.254: v59.05,28.57 v59.05,34.92 | v54.93,34.92 v54.93,31.75 | v70.48,30.48 v70.48,25.4 | v76.2,25.4 v76.2,8.89 | v95.89,11.43 96.84,12.06 98.11,14.61 100.33,14.61 v100.97,15.24
!FIRQ
  Top 0.254: U4.4 JP1.4 99.06,68.58 R3.2
!HALT
  Top 0.254: U4.40 JP4.1 R4.2
!IRQ
  Top 0.254: U4.3 JP1.3 R6.2
!NMI
  Top 0.254: U4.2 JP1.2 R5.2
!Q
  Top 0.254: U10.6 41.91,20.32 41.91,17.78 52.7,17.78 54.61,20.32 77.47,20.32 80.64,19.05 83.82,18.41 U7.4 U7.5
!RESET  (via drill 0.51)
  Top 0.254: J2.2 12.7,44.45 25.4,44.45 26.67,45.72 v36.83,45.72 | v36.83,74.93 U1.34 | v45.72,82.23 v51.44,82.23 | v57.15,81.92 59.69,81.92 60.96,78.74 127,78.74 v128.27,77.47 R9.2 | U4.37 JP4.4
  Bottom 0.254: v36.83,45.72 v36.83,74.93 | U1.34 45.72,77.47 v45.72,82.23 | v51.44,82.23 52.07,81.92 55.88,82.23 v57.15,81.92 | v128.27,77.47 128.27,69.85 U4.37
!VP931_RDEN  (via drill 0.51)
  Top 0.254: v31.11,9.53 31.75,9.21 59.69,9.21 65.72,8.89 66.99,6.35 83.5,6.35 v83.82,6.67 | U7.12 83.28,20.84 v83.82,20.32
  Bottom 0.254: DB1.P10 v31.11,9.53 | v83.82,20.32 v83.82,6.67
!VP931_WREN  (via drill 0.51)
  Top 0.254: v32.38,10.16 33.02,9.84 59.69,9.84 66.04,9.53 67.31,6.99 82.87,6.99 83.82,7.62 85.09,6.99 v87.63,6.99 | U7.8 v87.63,24.13
  Bottom 0.254: DB1.P22 v32.38,10.16 | v87.63,24.13 v87.63,6.99
A0  (via drill 0.51)
  Top 0.254: U1.36 v52.07,80.01 | v59.37,70.48 U2.8 v69.22,70.48 | v69.22,43.18 U3.10 | v76.2,62.23 96.52,62.23 JP1.8 U4.8
  Bottom 0.254: v52.07,80.01 59.37,80.01 v59.37,70.48 | v69.22,70.48 v69.22,43.18 | U3.10 76.2,45.72 v76.2,62.23
A1  (via drill 0.51)
  Top 0.254: U1.35 v58.42,77.47 | v58.42,69.22 U2.7 v68.26,69.22 | v67.94,45.72 U3.9 v87.63,45.72 | v88.9,58.42 91.44,58.42 92.71,57.15 104.14,57.15 JP1.9 U4.9
  Bottom 0.254: v58.42,77.47 v58.42,69.22 | v67.94,45.72 68.58,46.99 68.58,68.58 v68.26,69.22 | v87.63,45.72 88.27,46.67 88.27,55.88 v88.9,58.42
A2  (via drill 0.51)
  Top 0.254: U2.6 v67.31,67.94 | v67.31,48.26 U3.8 v91.44,48.26 | v91.44,52.07 97.79,52.07 JP1.10 U4.10
  Bottom 0.254: v67.31,67.94 67.31,67.31 67.63,66.67 67.31,65.72 67.31,59.69 66.99,59.05 66.99,51.75 67.31,50.8 v67.31,48.26 | v91.44,48.26 v91.44,52.07
A3  (via drill 0.51)
  Top 0.254: U2.5 v66.67,66.67 | v66.36,50.8 U3.7 81.28,52.07 v90.17,52.07 | v90.17,45.72 93.98,44.45 95.25,44.45 v96.52,45.72 | v96.52,50.8 JP1.11 U4.11
  Bottom 0.254: v66.67,66.67 66.67,62.23 66.04,59.69 66.36,58.42 v66.36,50.8 | v90.17,52.07 v90.17,45.72 | v96.52,45.72 v96.52,50.8
A4  (via drill 0.51)
  Top 0.254: U2.4 v65.72,65.41 | v65.41,53.34 U3.6 v87.31,53.34 | v87.31,50.8 91.44,50.8 92.71,49.53 97.79,49.53 JP1.12 U4.12
  Bottom 0.254: v65.72,65.41 66.04,64.77 66.04,63.5 65.72,63.18 65.72,62.23 65.41,61.59 65.41,59.05 65.72,58.42 65.41,57.78 65.41,56.52 65.72,55.88 65.41,55.24 v65.41,53.34 | v87.31,53.34 v87.31,50.8
A5  (via drill 0.51)
  Top 0.254: U2.3 v65.09,64.14 | v64.77,55.88 U3.5 v86.36,55.88 | v86.36,46.99 97.79,46.99 JP1.13 U4.13
  Bottom 0.254: v65.09,64.14 65.09,62.23 64.77,61.59 64.77,59.05 65.09,58.42 64.77,57.78 v64.77,55.88 | v86.36,55.88 v86.36,46.99
A6  (via drill 0.51)
  Top 0.254: U2.2 v64.14,62.87 | v64.14,58.42 U3.4 v85.09,58.42 | v85.09,43.18 91.44,43.18 92.71,41.91 95.25,41.91 96.52,43.18 JP1.14 U4.14
  Bottom 0.254: v64.14,62.87 v64.14,58.42 | v85.09,58.42 v85.09,43.18
A7  (via drill 0.51)
  Top 0.254: U2.1 63.5,61.59 63.5,60.96 U3.3 v83.82,60.96 | v83.82,40.64 91.44,40.64 92.71,39.37 95.25,39.37 96.52,40.64 JP1.15 U4.15
  Bottom 0.254: v83.82,60.96 v83.82,40.64
A8  (via drill 0.51)
  Top 0.254: U2.23 56.52,62.87 v56.83,62.55 | v56.83,59.05 58.42,59.69 91.44,59.69 U3.25 v97.79,58.42 | U4.16 JP1.16 v99.06,38.1
  Bottom 0.254: v56.83,62.55 57.15,62.23 57.15,59.69 v56.83,59.05 | v97.79,58.42 97.79,52.07 99.06,50.8 v99.06,38.1
A9  (via drill 0.51)
  Top 0.254: U2.22 54.93,64.14 55.88,63.5 v57.47,63.5 | v57.15,57.15 91.44,57.15 U3.24 v99.06,55.88 | U4.17 JP1.17 v100.33,35.56
  Bottom 0.254: v57.47,63.5 57.78,62.55 57.78,58.42 v57.15,57.15 | v99.06,55.88 99.06,52.07 100.33,50.8 v100.33,35.56
A10  (via drill 0.51)
  Top 0.254: U2.19 53.66,67.94 54.61,67.31 57.15,67.31 v58.42,66.36 | v57.15,49.53 91.44,49.53 U3.21 100.33,48.26 v102.87,47.62 | JP1.18 U4.18
  Bottom 0.254: v58.42,66.36 58.42,50.8 v57.15,49.53 | v102.87,47.62 102.87,33.02 JP1.18
A11  (via drill 0.51)
  Top 0.254: U4.19 JP1.19 v101.6,30.48 | U3.23 v100.33,53.34
  Bottom 0.254: v100.33,53.34 100.33,52.07 101.6,50.8 v101.6,30.48
A12  (via drill 0.51)
  Top 0.254: U3.2 v82.55,63.5 | v82.55,27.94 JP1.20 U4.20
  Bottom 0.254: v82.55,63.5 v82.55,27.94
A13  (via drill 0.51)
  Top 0.254: v97.79,26.67 124.46,26.67 U4.21 JP4.20 | U11.1 v125.73,18.41
  Bottom 0.254: U3.26 96.52,60.96 96.52,52.07 97.79,50.8 v97.79,26.67 | v125.73,18.41 U4.21
A14  (via drill 0.51)
  Top 0.254: U4.22 JP4.19 | U11.2 104.78,20.32 106.68,20.32 107.95,19.05 123.19,19.05 v123.83,19.68
  Bottom 0.254: v123.83,19.68 123.83,29.21 U4.22
A15  (via drill 0.51)
  Top 0.254: U4.23 JP4.18 | U11.3 103.5,20.95 107.95,20.95 109.22,19.68 121.92,19.68 v122.56,20.32
  Bottom 0.254: v122.56,20.32 123.19,21.59 123.19,30.48 U4.23
CS0/CS1
  Top 0.254: R10.2 48.26,44.45 U1.22 40.64,45.72 40.64,48.26 U1.24
D0  (via drill 0.51)
  Top 0.254: v55.56,72.39 56.2,71.75 U2.9 v70.17,71.75 | U6.18 v60.33,28.57 | v60.33,44.45 v70.17,44.45 91.44,44.45 U3.19 97.79,44.45 v121.92,44.45 | v121.92,53.34 U4.31 JP4.10
  Bottom 0.254: U1.33 45.72,71.12 48.58,70.48 55.24,70.48 v55.56,72.39 | v70.17,71.75 v70.17,44.45 | v60.33,28.57 v60.33,44.45 | v121.92,44.45 v121.92,53.34
D1  (via drill 0.51)
  Top 0.254: v56.52,73.03 U2.10 v71.12,73.03 | U6.17 v61.59,28.57 | v61.59,41.91 v71.12,41.91 91.44,41.91 U3.18 95.25,40.64 96.52,41.91 v120.65,41.91 | v120.65,50.8 U4.30 JP4.11
  Bottom 0.254: U1.32 55.88,69.85 v56.52,73.03 | v71.12,73.03 v71.12,41.91 | v61.59,28.57 v61.59,41.91 | v120.65,41.91 v120.65,50.8
D2  (via drill 0.51)
  Top 0.254: v57.47,74.3 U2.11 v72.39,74.3 | U3.11 v72.39,40.64 v62.87,40.64 | U6.16 v62.87,28.57 | v76.2,31.75 v123.19,31.75 | v123.19,48.26 U4.29 JP4.12
  Bottom 0.254: U1.31 55.88,67.31 57.47,73.34 v57.47,74.3 | v72.39,40.64 v72.39,74.3 | v62.87,28.57 v62.87,40.64 | U3.11 76.2,38.1 v76.2,31.75 | v123.19,31.75 v123.19,48.26
D3  (via drill 0.51)
  Top 0.254: U1.30 45.72,64.77 45.72,75.56 U2.13 | U6.15 v64.14,28.57 | v64.14,36.83 91.44,36.83 U3.16 v99.06,35.56 | v64.14,50.8 v40.64,50.8 | v99.06,29.21 v118.11,29.21 | v118.11,45.72 U4.28 JP4.13
  Bottom 0.254: v64.14,28.57 v64.14,36.83 v64.14,50.8 | v40.64,50.8 40.64,64.77 U1.30 | v99.06,35.56 v99.06,29.21 | v118.11,29.21 v118.11,45.72
D4  (via drill 0.51)
  Top 0.254: U2.14 46.35,74.3 46.35,62.23 U1.29 v39.37,62.23 | U6.14 v65.41,28.57 | v65.41,34.29 91.44,34.29 U3.15 v100.33,33.02 | v65.41,52.07 63.5,53.34 v39.37,53.34 | v100.33,25.4 v116.84,25.4 | v116.84,43.18 U4.27 JP4.14
  Bottom 0.254: v65.41,28.57 v65.41,34.29 v65.41,52.07 | v39.37,53.34 v39.37,62.23 | v100.33,33.02 v100.33,25.4 | v116.84,25.4 v116.84,43.18
D5  (via drill 0.51)
  Top 0.254: U1.28 46.99,59.69 46.99,73.03 U2.15 53.98,73.03 54.29,73.34 55.56,73.98 56.2,75.25 58.1,75.56 60.33,75.25 60.96,76.2 62.23,76.83 63.5,76.2 v74.93,76.2 | U6.13 v66.67,28.57 | v66.67,35.56 v74.93,35.56 U3.13 91.44,35.56 92.71,34.29 v121.92,34.29 | v121.92,40.64 U4.26 JP4.15
  Bottom 0.254: v74.93,35.56 v74.93,76.2 | v66.67,28.57 v66.67,35.56 | v121.92,34.29 v121.92,40.64
D6  (via drill 0.51)
  Top 0.254: U1.27 47.62,59.37 47.62,71.75 v50.16,71.75 U2.16 | v50.16,76.52 50.48,76.83 57.15,76.83 59.69,76.2 62.23,77.47 v73.66,77.47 | U6.12 v67.94,28.57 | v67.94,38.1 v73.66,38.1 U3.12 91.44,38.1 92.71,36.83 v120.65,36.83 | v120.65,38.1 U4.25 JP4.16 | U12.11 124.46,16.51 v120.65,17.14
  Bottom 0.254: v50.16,71.75 v50.16,76.52 | v73.66,38.1 v73.66,77.47 | v67.94,28.57 v67.94,38.1 | v120.65,38.1 v120.65,36.83 v120.65,17.14
D7  (via drill 0.51)
  Top 0.254: U1.26 48.26,59.05 48.26,70.48 U2.17 v57.61,70.48 | U6.11 v69.22,28.57 | v59.05,39.37 v69.22,39.37 91.44,39.37 U3.17 95.25,38.1 96.52,39.37 v119.38,39.37 | v119.38,35.56 U4.24 JP4.17 | v128.27,16.51 v125.73,16.51 | U12.3 123.19,10.16 v124.14,10.79
  Bottom 0.254: v57.61,70.48 57.47,68.58 58.1,68.26 59.05,68.58 59.69,67.94 59.69,66.99 60.01,66.36 59.69,65.41 59.69,45.72 59.05,44.77 v59.05,39.37 | v69.22,28.57 v69.22,39.37 | v119.38,39.37 v119.38,35.56 | U4.24 128.27,34.29 v128.27,16.51 | v125.73,16.51 125.73,13.97 124.46,12.38 v124.14,10.79
E  (via drill 0.51)
  Top 0.254: U1.25 v53.34,52.07 | U10.9 v52.7,20.32 | v53.34,54.61 v89.85,54.61 v123.19,54.61 | v123.19,60.96 U4.34 JP4.7 R100.2 | U7.2 81.28,13.97 v88.9,13.97
  Bottom 0.254: v52.7,20.32 53.34,21.59 v53.34,52.07 v53.34,54.61 | v123.19,54.61 v123.19,60.96 | v88.9,13.97 88.9,53.34 v89.85,54.61
ENABLE_VP931_DATA  (via drill 0.51)
  Top 0.254: U9.8 33.02,24.13 JP8.7 40.01,25.08 40.01,29.84 v55.88,29.84 | v55.88,22.86 77.47,22.86 v78.74,21.59 | v78.74,25.4 81.28,25.4 | 81.28,25.4 U7.13 | U7.10 85.09,25.4 81.28,25.4
  Bottom 0.254: v55.88,29.84 57.78,28.89 57.78,24.13 v55.88,22.86 | v78.74,21.59 v78.74,25.4
GND  (via drill 0.51)
  Top 0.254: JP1.1 U4.1
  other vias: 56.2,28.26
  pour Top: 1.27,1.27 1.27,95.25 138.43,95.25 138.43,1.27
  pour Bottom: 2.54,2.54 2.54,93.98 137.16,93.98 137.16,2.54
HAND1  (via drill 0.51)
  Top 0.254: J2.11 13.97,76.2 35.56,76.2 41.91,78.74 53.34,78.74 R1.2 v50.8,83.82 | U1.40 JP3.1
  Bottom 0.254: U1.40 50.8,88.27 v50.8,83.82
HAND2  (via drill 0.51)
  Top 0.254: J2.12 13.97,81.28 v49.53,81.28 | v55.88,81.28 R2.2 | JP3.2 U1.39
  Bottom 0.254: v55.88,81.28 v49.53,81.28 49.53,86.36 U1.39
N$4
  Top 0.254: U7.6 86.36,18.41 91.44,18.41 92.71,20.32 99.69,20.32 U11.6
N$5  (via drill 0.51)
  Top 0.254: U10.10 v52.07,21.59 | v52.07,25.4 U10.13 | v52.07,27.94 41.27,27.94 40.64,26.67 | 40.64,26.67 40.64,22.86 U10.4 | U10.1 40.64,26.67 | v52.07,31.43 R11.2
  Bottom 0.254: v52.07,21.59 v52.07,25.4 v52.07,27.94 v52.07,31.43
N$8
  Top 1.016: J1.1 11.11,14.29 L1.P$1 C14.2
PA0
  Top 0.254: RN1.2 JP2.1 U1.2
  Bottom 0.254: J2.10 10.48,74.61 10.48,81.92 RN1.2
PA1
  Top 0.254: RN1.3 JP2.2 U1.3
  Bottom 0.254: J2.9 11.11,71.12 11.11,80.01 RN1.3
PA2
  Top 0.254: RN1.4 JP2.3 U1.4
  Bottom 0.254: J2.8 11.75,68.9 11.75,79.06 RN1.4
PA3
  Top 0.254: RN1.5 JP2.4 U1.5
  Bottom 0.254: J2.7 12.38,64.45 12.38,77.15 RN1.5
PA4
  Top 0.254: RN1.6 JP2.5 U1.6
  Bottom 0.254: J2.6 13.02,60.01 13.02,73.98 RN1.6
PA5
  Top 0.254: RN1.7 JP2.6 U1.7
  Bottom 0.254: J2.5 13.65,56.52 13.65,72.39 RN1.7
PA6
  Top 0.254: RN1.8 JP2.7 U1.8
  Bottom 0.254: J2.4 14.29,55.56 14.29,68.9 14.61,70.48 RN1.8
PA7
  Top 0.254: RN1.9 JP2.8 U1.9
  Bottom 0.254: RN1.9 15.24,68.58 14.92,67.94 14.92,51.75 J2.3
Q  (via drill 0.51)
  Top 0.254: U10.5 v47.94,21.59 | v47.94,24.77 49.53,24.13 U10.12 v77.47,24.13 | JP4.6 U4.35 v115.57,63.5 | U7.11 v83.82,24.13 | v77.47,26.67 v83.82,26.67 v90.17,26.67 | v90.17,24.13 v115.57,24.13
  Bottom 0.254: v47.94,21.59 v47.94,24.77 | v77.47,24.13 v77.47,26.67 | v83.82,24.13 v83.82,26.67 | v90.17,26.67 v90.17,24.13 | v115.57,24.13 v115.57,63.5
R/!W  (via drill 0.51)
  Top 0.254: JP7.1 22.86,35.56 U9.1 | v21.59,40.96 22.86,40.64 40.64,40.64 U1.21 v46.99,41.91 48.26,43.18 v54.61,43.18 | v55.88,64.77 55.88,65.41 U2.21 | v54.61,16.51 U6.1 57.78,19.05 77.47,19.05 80.01,17.78 U7.1 80.01,12.7 v90.17,12.7 | JP4.9 U4.32 v114.3,55.88 | v114.3,22.86 v90.17,22.86
  Bottom 0.254: v21.59,40.96 JP7.1 | v46.99,41.91 46.99,54.61 55.88,60.96 v55.88,64.77 | v54.61,16.51 53.98,22.23 53.98,41.91 v54.61,43.18 | v114.3,55.88 v114.3,22.86 | v90.17,22.86 v90.17,12.7
VCC  (via drill 0.51)
  Top 0.254: JP8.1 36.83,39.37 | U2.24 52.07,59.69 C2.1 | JP1.7 U4.7
  Top 0.61: U10.14 52.07,26.67 C11.1
  Top 1.016: C15.1 17.78,31.75 | 17.78,31.75 17.78,39.37 v30.48,39.37 | v30.48,39.37 v34.29,39.37 36.83,39.37 43.18,39.37 | 43.18,39.37 49.53,39.37 | 49.53,39.37 v52.07,39.37 R11.1 | U9.14 C10.1 v30.48,39.37 | 17.78,31.75 L1.P$2 | C1.1 25.4,43.18 U1.20 | R10.1 49.53,39.37 | 43.18,39.37 U$1.4 39.37,36.2 39.37,32.38 U$1.1 v46.35,32.07 | v46.99,26.67 U10.14 | C2.1 v52.07,55.88 | C11.1 55.88,26.67 U6.20 C7.1 | v21.59,92.71 v34.29,92.71 55.88,92.71 | 55.88,92.71 62.23,80.01 v78.74,80.01 v107.95,80.01 125.73,80.01 R9.1 132.08,82.55 R4.1 R100.1 | 55.88,92.71 R2.1 R1.1 | U3.1 v81.28,66.04 85.09,66.04 | 85.09,66.04 C3.1 | U3.28 85.09,66.04 | U3.28 U3.27 101.6,63.5 | 101.6,63.5 JP1.7 | U3.28 R12.1 R3.1 R6.1 R5.1 | v80.01,24.13 U7.14 | C8.1 v81.28,27.94 | v107.94,12.14 U11.16 | v107.94,12.14 v114.3,12.06 120.65,12.06 U12.14 C13.1 | v107.94,12.14 C12.1 | 101.6,63.5 C4.1
  Bottom 0.254: JP6.1 v114.3,12.06
  Bottom 1.016: RN1.1 v21.59,92.71 | v30.48,39.37 U1.20 | v46.35,32.07 46.99,28.57 v46.99,26.67 | v34.29,39.37 v34.29,92.71 | v52.07,55.88 v52.07,39.37 | U3.1 v78.74,80.01 | v81.28,66.04 v81.28,27.94 v80.01,24.13 | v107.95,80.01 107.95,25.4 v107.94,12.14
VP931_D0  (via drill 0.51)
  Top 0.254: v54.61,15.24 54.93,14.92 59.05,14.92 U6.2
  Bottom 0.254: DB1.P14 54.61,7.62 v54.61,15.24
VP931_D1  (via drill 0.51)
  Top 0.254: v51.75,14.61 52.39,14.29 60.33,14.29 U6.3
  Bottom 0.254: DB1.P15 51.75,7.3 v51.75,14.61
VP931_D2  (via drill 0.51)
  Top 0.254: v48.9,13.97 49.53,13.65 61.59,13.65 U6.4
  Bottom 0.254: DB1.P16 v48.9,13.97
VP931_D3  (via drill 0.51)
  Top 0.254: v46.35,13.34 46.99,13.02 62.87,13.02 U6.5
  Bottom 0.254: DB1.P17 v46.35,13.34
VP931_D4  (via drill 0.51)
  Top 0.254: v43.5,12.7 44.45,12.38 64.14,12.38 U6.6
  Bottom 0.254: DB1.P18 v43.5,12.7
VP931_D5  (via drill 0.51)
  Top 0.254: v40.64,12.06 41.27,11.75 65.41,11.75 U6.7
  Bottom 0.254: DB1.P19 v40.64,12.06
VP931_D6  (via drill 0.51)
  Top 0.254: v38.1,11.43 38.73,11.11 66.67,11.11 U6.8
  Bottom 0.254: DB1.P20 v38.1,11.43
VP931_D7  (via drill 0.51)
  Top 0.254: v35.24,10.79 35.88,10.48 67.94,10.48 U6.9
  Bottom 0.254: DB1.P21 v35.24,10.79
VP931_DAK  (via drill 0.51)
  Top 0.254: v29.84,8.57 59.69,8.57 65.41,8.26 66.67,5.71 121.6,5.71 121.92,6.35 U12.2
  Bottom 0.254: v29.84,8.57 DB1.P23
VP931_DAV  (via drill 0.51)
  Top 0.254: v28.57,8.26 29.53,7.62 30.8,7.94 59.69,7.94 64.77,7.62 66.04,5.08 121.92,5.08 v123.19,5.71 | v123.19,12.38 U12.12
  Bottom 0.254: DB1.P11 v28.57,8.26 | v123.19,5.71 v123.19,12.38
W/!R  (via drill 0.51)
  Top 0.254: JP7.2 24.13,33.02 25.4,31.75 U9.2 v29.21,31.75 | v57.15,66.04 55.88,66.67 U2.20 v49.53,66.04 | v27.94,16.51 53.34,16.51 54.93,19.05 55.88,19.68 77.47,19.68 80.64,18.41 v81.28,18.1 | v81.28,19.68 82.55,19.37 85.09,19.37 86.36,19.68 U7.9
  Bottom 0.254: v29.21,31.75 34.29,33.02 40.64,33.02 40.64,38.1 45.72,38.1 45.72,54.61 54.61,60.96 54.61,66.04 v57.15,66.04 | v49.53,66.04 38.1,66.04 38.1,41.91 34.29,36.83 27.94,33.02 v27.94,16.51 | v81.28,18.1 v81.28,19.68

### Text on the board
Unrouted: WARNING: / J1 and J2 to be installed backward from what the silkscreen indicates. / Backward meaning rotated 180 degrees.
tPlace: FREEDOM FIGHTER PROTOTYPE / PIF BOARD REPLACEMENT (v1) | by Matt Ownby (2015) / www.rulecity.com